# Altium schematic sheet lm2576TO263-5.SchDoc
size A
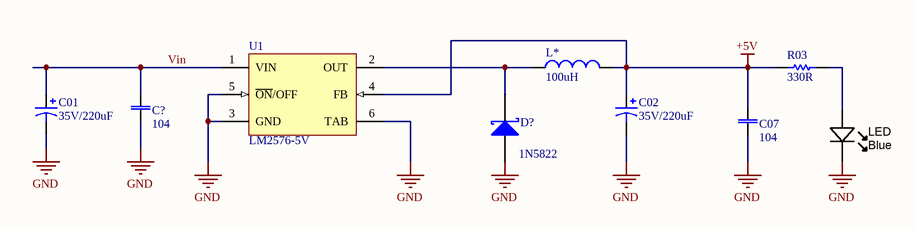
[diagram p0: lm2576TO263-5.SchDoc]

## Parts
C01  value 35V/220uF  [CAPE3.5-5.0MM_Rad_10x14mm]  (hidden comment: Tụ nhôm cắm35V/220uF)
C02  value 35V/220uF  [CAPE3.5-5.0MM_Rad_10x14mm]  (hidden comment: Tụ nhôm cắm35V/220uF)
C07  value 104  [CAPC2012N_F]  (hidden comment: Tụ điện dán 0805104)
C?  value 104  [CAPC2012N_F]  (hidden comment: Tụ điện dán 0603104)
D?  value 1N5822  [DO-201]  (hidden comment: Đi ốt cắm1N5822)
L*  value 100uH  [Inductor 12x12x6]  (hidden comment: Cuộn cảm dán100uH)
LED  Blue  [LED-0805-K]
R03  value 330R  [RESC2012N_F]  (hidden comment: Điện trở dán 0805330R)
U1  LM2576-5V  [TS5B_N]

## Nets
+5V: C02.1 C07.2 L*.2 R03.2 U1.4(FB)
GND: C01.2 C02.2 C07.1 C?.1 D?.A LED.K U1.3(GND) U1.5(~{ON}/OFF) U1.6(TAB)
Vin: C01.1 C?.2 U1.1(VIN)
NetD?_K: D?.K L*.1 U1.2(OUT)
NetLED_A: LED.A R03.1

## Library data of the parts
C01 C02 = Cap: cm: Tụ nhôm cắm
C07 = CAP NP: Capacitor non polarized; cm1: Tụ điện dán 0603; cm3: Tụ điện dán 1206; cm2: Tụ điện dán 0805
C? = CAP NP: Capacitor non polarized; cm2: Tụ điện dán 0805; cm3: Tụ điện dán 1206; cm1: Tụ điện dán 0603
D? = Schottky Diodes: Schottky Diodes Through Hole 3 A 40 V Schottky Diodes, DO-201AD, SB340 ,MBR340; cm2: Đi ốt dán; cm1: Đi ốt cắm
L* = Inductor: cm2: Cuộn cảm cắm; cm1: Cuộn cảm dán
LED = LED_SMD_Blue_0805_100mcd: LED 0805 SMD Blue 100mcd 470nm; Manufacturer 1: Ligitek; Manufacturer Part Number 1: LG-170DBKZ-CT; Ratings: 100 mcd; 470 nm; Package / Case: 0805; Material: InGaN/GaN; Value: Blue; Color: Blue
R03 = Res: Resistor; cm1: Điện trở dán 0603; cm2: Điện trở cắm 1/4W; cm4: Điện trở dán 1206; cm3: Điện trở dán 0805
U1 = LM2596S-ADJ: SIMPLE SWITCHER Power Converter 150 KHz 3A Step-Down Voltage Regulator; Manufacturer: National Semiconductor; PackageTopMarking: NSUZXYTT*LM2596S*-ADJ P+; PowerWise: N; FirstPublished: 4-Dec-2008; DatasheetVersion: May-2002; PackageVersion: revD, Apr-2005; PackageReference: TS5B; Publisher: Altium Limited; PackageDescription: TO-263, Molded, .400 x .390 x .180in, 5 Lead, .067in Pitch, Surface Mount; CompType: Switcher; PartNumber: LM2576-5V; RoHS: O; PinCount: 5; DigiKeyPartNumber: LM2596S-ADJ-ND; Code_JEDEC: MO-169-AB; ComponentLink1Description: LM2596 Datasheet; ComponentLink1URL: http://www.national.com/ds/LM/LM2596.pdf; ComponentLink2Description: LM2596 Web Page; ComponentLink2URL: http://www.national.com/pf/LM/LM2596.html; ComponentLink3Description: TS5B Package Page; ComponentLink3URL: http://www.national.com/packaging/folders/ts5b.html